# Altium schematic sheet Connectors.SchDoc
size A4; Revision: 1.0; SheetNumber: 4; SheetTotal: 5
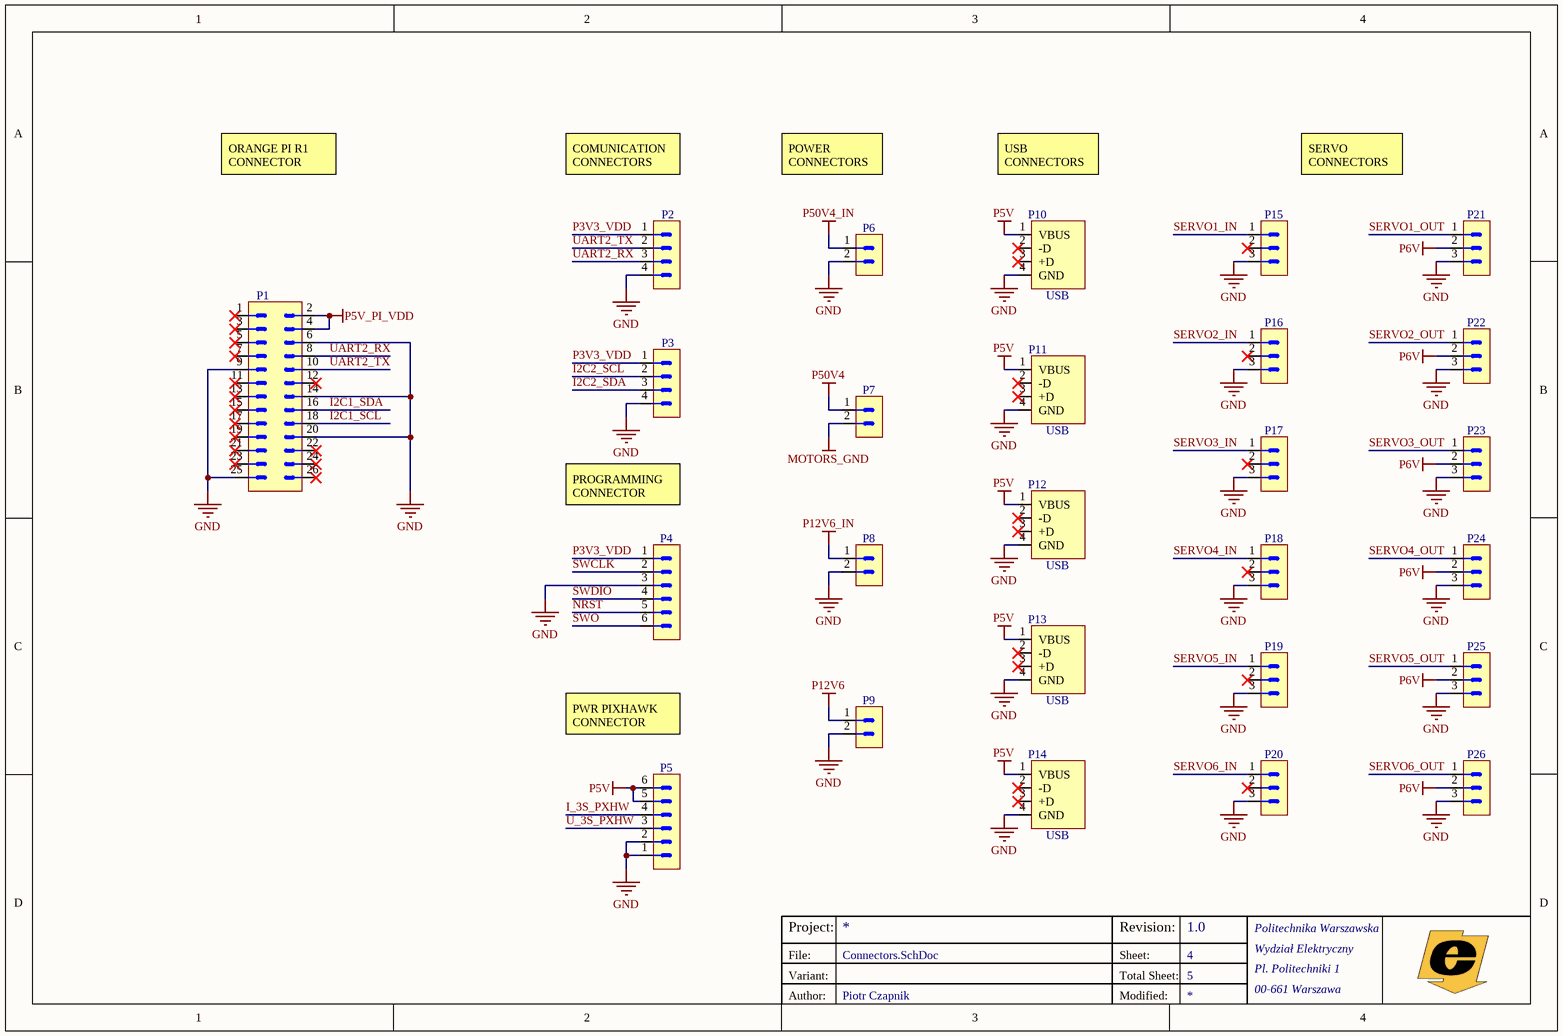
[diagram p0: Connectors.SchDoc]

## Parts
P1  SAMTEC_SSW-113-02-G-D  [SAMTEC_SSW-113-02-G-D]  (value not drawn)
P2  SAMTEC_TSW-104-07-G-S  [SAMTEC_TSW-104-07-G-S]  (value not drawn)
P3  (no value)  [BM04B-GHS-TBT]
P4  MTLW-106-07-L-S-250  [SAMTEC_MTLW-106-07-L-S-250]  (value not drawn)
P5  (no value)  [BM06B-GHS-TBT]
P6  XT60PW-M  [XT60PW-M]  (value not drawn)
P7  XT60PW-F  [XT60PW-F]  (value not drawn)
P8  XT60PW-M  [XT60PW-M]  (value not drawn)
P9  XT60PW-F  [XT60PW-F]  (value not drawn)
P10  USB  [USB-A-S-RA]
P11  USB  [USB-A-S-RA]
P12  USB  [USB-A-S-RA]
P13  USB  [USB-A-S-RA]
P14  USB  [USB-A-S-RA]
P15  826926-3  [Header_3x1_2.54mm_M]  (value not drawn)
P16  826926-3  [Header_3x1_2.54mm_M]  (value not drawn)
P17  826926-3  [Header_3x1_2.54mm_M]  (value not drawn)
P18  826926-3  [Header_3x1_2.54mm_M]  (value not drawn)
P19  826926-3  [Header_3x1_2.54mm_M]  (value not drawn)
P20  826926-3  [Header_3x1_2.54mm_M]  (value not drawn)
P21  826926-3  [Header_3x1_2.54mm_M]  (value not drawn)
P22  826926-3  [Header_3x1_2.54mm_M]  (value not drawn)
P23  826926-3  [Header_3x1_2.54mm_M]  (value not drawn)
P24  826926-3  [Header_3x1_2.54mm_M]  (value not drawn)
P25  826926-3  [Header_3x1_2.54mm_M]  (value not drawn)
P26  826926-3  [Header_3x1_2.54mm_M]  (value not drawn)

## Nets
GND: P1.6 P1.9 P1.14 P1.20 P1.25 P2.4 P3.4 P4.3 P5.1 P5.2 P6.2 P8.2 P9.2 P10.4(GND) P11.4(GND) P12.4(GND) P13.4(GND) P14.4(GND) P15.3 P16.3 P17.3 P18.3 P19.3 P20.3 P21.3 P22.3 P23.3 P24.3 P25.3 P26.3
MOTORS_GND: P7.2
P5V: P5.5 P5.6 P10.1(VBUS) P11.1(VBUS) P12.1(VBUS) P13.1(VBUS) P14.1(VBUS)
P5V_PI_VDD: P1.2 P1.4
P6V: P21.2 P22.2 P23.2 P24.2 P25.2 P26.2
P12V6: P9.1
P12V6_IN: P8.1
P50V4: P7.1
P50V4_IN: P6.1
I2C1_SCL: P1.18
I2C1_SDA: P1.16
I2C2_SCL: P3.2
I2C2_SDA: P3.3
I_3S_PXHW: P5.4
NRST: P4.5
P3V3_VDD: P2.1 P3.1 P4.1
SERVO1_IN: P15.1
SERVO1_OUT: P21.1
SERVO2_IN: P16.1
SERVO2_OUT: P22.1
SERVO3_IN: P17.1
SERVO3_OUT: P23.1
SERVO4_IN: P18.1
SERVO4_OUT: P24.1
SERVO5_IN: P19.1
SERVO5_OUT: P25.1
SERVO6_IN: P20.1
SERVO6_OUT: P26.1
SWCLK: P4.2
SWDIO: P4.4
SWO: P4.6
U_3S_PXHW: P5.3
UART2_RX: P1.8 P2.3
UART2_TX: P1.10 P2.2

Not connected (* = marked no-connect by the designer): P1 1* 3* 5* 7* 11(12)* 12* 13* 15* 17* 19* 21* 22* 23* 24* 26*; P10 2(-D)* 3(+D)*; P11 2(-D)* 3(+D)*; P12 2(-D)* 3(+D)*; P13 2(-D)* 3(+D)*; P14 2(-D)* 3(+D)*; P15 2*; P16 2*; P17 2*; P18 2*; P19 2*; P20 2*

## Notes on the sheet
- ORANGE PI R1 CONNECTOR
- COMUNICATION CONNECTORS
- POWER CONNECTORS
- USB CONNECTORS
- SERVO CONNECTORS
- PROGRAMMING CONNECTOR
- PWR PIXHAWK CONNECTOR
- Project:
- Variant:
- File:
- Sheet:
- Revision:
- Total Sheet:
- Politechnika Warszawska
- Wydział Elektryczny
- Pl. Politechniki 1
- Author:
- Piotr Czapnik
- Modified:
- 00-661 Warszawa

## Library data of the parts
P1 = HDR_THT_13X2V_F_2P54MM: General Purpose Header: THT, 2.54mm, Female, Straight; Manufacturer: GENERIC; Manufacturer 1 Example: Samtec; Manufacturer 1 Component Height: 8.5mm; Current Max: 4.7A; PressFit: No; DesignItemId: HDR_THT_13X2V_F_2P54MM; Author: PC; Family: SSW; Component Kind: Standard; HelpURL: https://pl.mouser.com/datasheet/2/527/ssw_th-1507658.pdf; Manufacturer Part Number: SAMTEC_SSW-113-02-G-D; Manufacturer 1 Part Number: SAMTEC_SSW-113-02-G-D; Mounted: Yes; Part Description: General Purpose Header: THT, 2.54mm, Female, Straight; Pin Count: 26; Sense: No; SMD: No; Socket: No; Status: Recommended; Supplier 1: Mouser; Create Date: 18.03.2020; LatestRevisionDate: 18.03.2020; Supplier Part Number 1: 200-SSW11302GD
P2 = HDR_THT_4X1V_M_2P54MM: General Purpose Header: THT, 2.54mm, Male, Straight; Manufacturer: GENERIC; Manufacturer 1 Example: Samtec; Manufacturer 1 Component Height: 8.5mm; PressFit: No; DesignItemId: HDR_THT_4X1V_M_2P54MM; Author: PC; Family: TSW; Component Kind: Standard; HelpURL: http://suddendocs.samtec.com/catalog_english/tsw_th.pdf; Manufacturer Part Number: SAMTEC_TSW-104-07-G-S; Manufacturer 1 Part Number: SAMTEC_TSW-104-07-G-S; Mounted: Yes; Part Description: General Purpose Header: THT, 2.54mm, Male, Straight; Pin Count: 4; Sense: No; SMD: No; Socket: No; Status: Recommended; Supplier 1: Mouser; Create Date: 18.03.2020; LatestRevisionDate: 18.03.2020; Supplier Part Number 1: 200-TSW10407GS
P3 = JST_GH_4PIN_V: JST GH series 4 pin vertical SMT connector, pitch 1.25mm, Right Angle; Manufacturer Part Number: BM04B-GHS-TBT (LF)(SN); Manufacturer 1 Component Height: 4.05mm; PressFit: No; DesignItemId: JST_GH_4PIN_V; Author: PC; Family: GH; Component Kind: Standard; HelpURL: http://www.farnell.com/datasheets/2082975.pdf?_ga=2.136648627.2050948970.1584303774-2014276691.1568213371; Manufacturer: JST; Mounted: Yes; Part Description: JST GH series 4 pin vertical SMT connector, pitch 1.25mm, Right Angle; Pin Count: 4; Sense: No; SMD: Yes; Socket: No; Status: Recommended; Supplier 1: Digi-Key; Supplier 2: Farnell; Create Date: 16.03.2020; LatestRevisionDate: 16.03.2020; Supplier Part Number 1: 455-1580-2-ND; Supplier Part Number 2: 1516208
P4 = HDR_THT_6X1V_M_2P54MM: General Purpose Header: THT, 2.54mm, Male, Straight; Manufacturer: GENERIC; Manufacturer 1 Example: Samtec; Manufacturer 1 Component Height: 10.92mm; Current Max: 5.2A; PressFit: No; DesignItemId: HDR_THT_6X1V_M_2P54MM; Author: PC; Family: MLTW; Component Kind: Standard; Footprint: HDR_6X1V_M_2P54MM; HelpURL: https://pl.mouser.com/datasheet/2/527/mtlw_th-1370324.pdf; Manufacturer Part Number: HDR_THT_6X1V_M_2P54MM; Manufacturer 1 Part Number: MTLW-106-07-L-S-250; Mounted: Yes; Part Description: General Purpose Header: THT, 2.54mm, Male, Straight; Pin Count: 6; Sense: No; SMD: No; Socket: No; Status: Recommended; Supplier 1: Mouser; Supplier 2: Digi-Key; Create Date: 19.08.2012; LatestRevisionDate: 19.08.2012; Supplier Part Number 1: 200-MTLW10607LS250
P5 = JST_GH_6PIN_V: JST GH series 6 pin vertical SMT connector, pitch 1.25mm, Right Angle; Manufacturer Part Number: BM06B-GHS-TBT (LF)(SN); Manufacturer 1 Component Height: 4.05mm; PressFit: No; DesignItemId: JST_GH_6PIN_V; Author: PC; Family: GH; Component Kind: Standard; HelpURL: http://www.farnell.com/datasheets/2082975.pdf?_ga=2.136648627.2050948970.1584303774-2014276691.1568213371; Manufacturer: JST; Mounted: Yes; Part Description: JST GH series 6 pin vertical SMT connector, pitch 1.25mm, Right Angle; Pin Count: 6; Sense: No; SMD: Yes; Socket: No; Status: Recommended; Supplier 1: Digi-Key; Supplier 2: rs-online; Create Date: 18.03.2020; LatestRevisionDate: 18.03.2020; Supplier Part Number 1: 455-1582-2-ND; Supplier Part Number 2: 752-1771
P6 P8 = XT60PW-M: XT60 male connector, right angle, 2 Positions, THT, 17.2x15.5mm body; Manufacturer: GENERIC; Manufacturer 1 Example: AMASS; Manufacturer 1 Component Height: 10.9mm; Current Max: 30A; PressFit: No; Voltage Max: 500V; DesignItemId: XT60PW-M; Author: PC; Family: XT60; Component Kind: Standard; HelpURL: https://www.tme.eu/Document/9b8d0c5eb7094295f3d3112c214d3ade/XT60PW%20SPEC.pdf; Manufacturer Part Number: XT60PW-M; Manufacturer 1 Part Number: XT60PW-M; Mounted: Yes; Part Description: XT60 male connector, right angle, 2 Positions, THT, 17.2x15.5mm body; Pin Count: 2; Sense: No; SMD: No; Socket: No; Status: Recommended; Supplier 1: TME; Create Date: 15.03.2020; LatestRevisionDate: 15.03.2020; Supplier Part Number 1: XT60PW-M
P7 P9 = XT60PW-F: XT60 female connector, right angle, 2 Positions, THT, 17.2x15.5mm body; Manufacturer: GENERIC; Manufacturer 1 Example: AMASS; Manufacturer 1 Component Height: 10.9mm; Current Max: 30A; PressFit: No; Voltage Max: 500V; DesignItemId: XT60PW-F; Author: PC; Family: XT60; Component Kind: Standard; HelpURL: https://www.tme.eu/Document/9b8d0c5eb7094295f3d3112c214d3ade/XT60PW%20SPEC.pdf; Manufacturer Part Number: XT60PW-F; Manufacturer 1 Part Number: XT60PW-F; Mounted: Yes; Part Description: XT60 female connector, right angle, 2 Positions, THT, 17.2x15.5mm body; Pin Count: 2; Sense: No; SMD: No; Socket: No; Status: Recommended; Supplier 1: TME; Create Date: 15.03.2020; LatestRevisionDate: 15.03.2020; Supplier Part Number 1: XT60PW-F
P10-P14 = USB-A: USB 2.0 Type A Female Connector 4-Pin THT; Manufacturer: GENERIC; Manufacturer 1 Example: ADAM TECH; Manufacturer 1 Component Height: 6.9mm; PressFit: No; DesignItemId: USB-A; Author: BS; Family: USB; Component Kind: Standard; HelpURL: https://www.tme.eu/Document/eeaaeff341ffd60fb24eb1a497f68654/826926-2.pdf; Manufacturer Part Number: USB-A-S-RA; Manufacturer 1 Part Number: USB-A-S-RA; Mounted: Yes; Part Description: USB 2.0 Type A Female Connector 4-Pin THT; Pin Count: 4; Sense: No; SMD: No; Socket: No; Status: Recommended; Supplier 1: TME; Create Date: 16.09.2019; LatestRevisionDate: 14.03.2019; Supplier Part Number 1: USB-A-S-RA
P15-P26 = HDR_THT_3X1V_M_2P54MM: General Purpose Header: THT, 2.54mm, Male, Straight; Manufacturer: GENERIC; Manufacturer 1 Example: TE Connectivity; Manufacturer 1 Component Height: 12.7mm; PressFit: No; DesignItemId: HDR_THT_3X1V_M_2P54MM; Author: JK; Family: AMPMODU MOD II; Component Kind: Standard; HelpURL: https://www.tme.eu/Document/eeaaeff341ffd60fb24eb1a497f68654/826926-2.pdf; Manufacturer Part Number: 826926-3; Manufacturer 1 Part Number: 826926-3; Mounted: Yes; Part Description: General Purpose Header: THT, 2.54mm, Male, Straight; Pin Count: 3; Sense: No; SMD: No; Socket: No; Status: Recommended; Supplier 1: TME; Supplier 2: Farnell; Supplier 3: Digi-Key; Create Date: 16.09.2019; LatestRevisionDate: 16.09.2019; Supplier Part Number 1: 826926-3; Supplier Part Number 2: 1248141; Supplier Part Number 3: A106483-ND